# EAGLE schematic dsub (EAGLE 9.5.1)
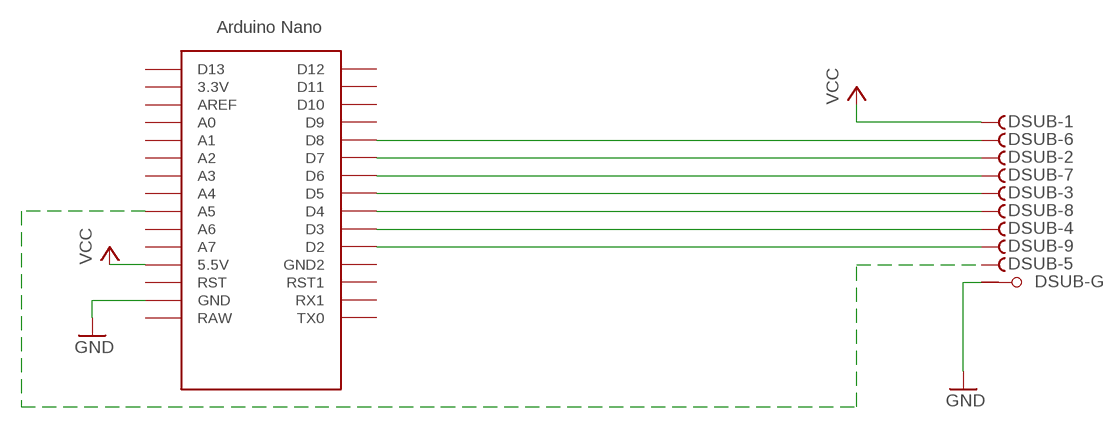
[diagram p0: schematic, sheet 1]

## Parts
DSUB  F09HPS  [F09HP]
U$1  NANO  [NANO]

## Nets
GND: DSUB.G1(-G:G1) U$1.GND
N$1: DSUB.5(-5:F) U$1.A5
N$10: DSUB.2(-2:F) U$1.D7
N$11: DSUB.7(-7:F) U$1.D6
N$12: DSUB.3(-3:F) U$1.D5
N$13: DSUB.8(-8:F) U$1.D4
N$14: DSUB.4(-4:F) U$1.D3
N$15: DSUB.9(-9:F) U$1.D2
N$16: DSUB.6(-6:F) U$1.D8
VCC: DSUB.1(-1:F) U$1.5V(5.5V)
Unconnected: DSUB.G2(-G:G2) U$1.3.3V U$1.A0 U$1.A1 U$1.A2 U$1.A3 U$1.A4 U$1.A6 U$1.A7 U$1.AREF U$1.D9 U$1.D10 U$1.D11 U$1.D12 U$1.D13 U$1.GND1(GND2) U$1.ICSP1 U$1.ICSP2 U$1.ICSP3 U$1.ICSP4 U$1.ICSP5 U$1.ICSP6 U$1.RAW U$1.RST U$1.RST1 U$1.RX1 U$1.TX0

## Library data of the parts
DSUB = con-subd:F09HPS: SUB-D; OC_FARNELL: unknown; OC_NEWARK: unknown
U$1 = Arduino-clone:NANO: Arduino Nano